# EAGLE design 3_Phase_Controller_V0.1 (EAGLE 9.6.2)
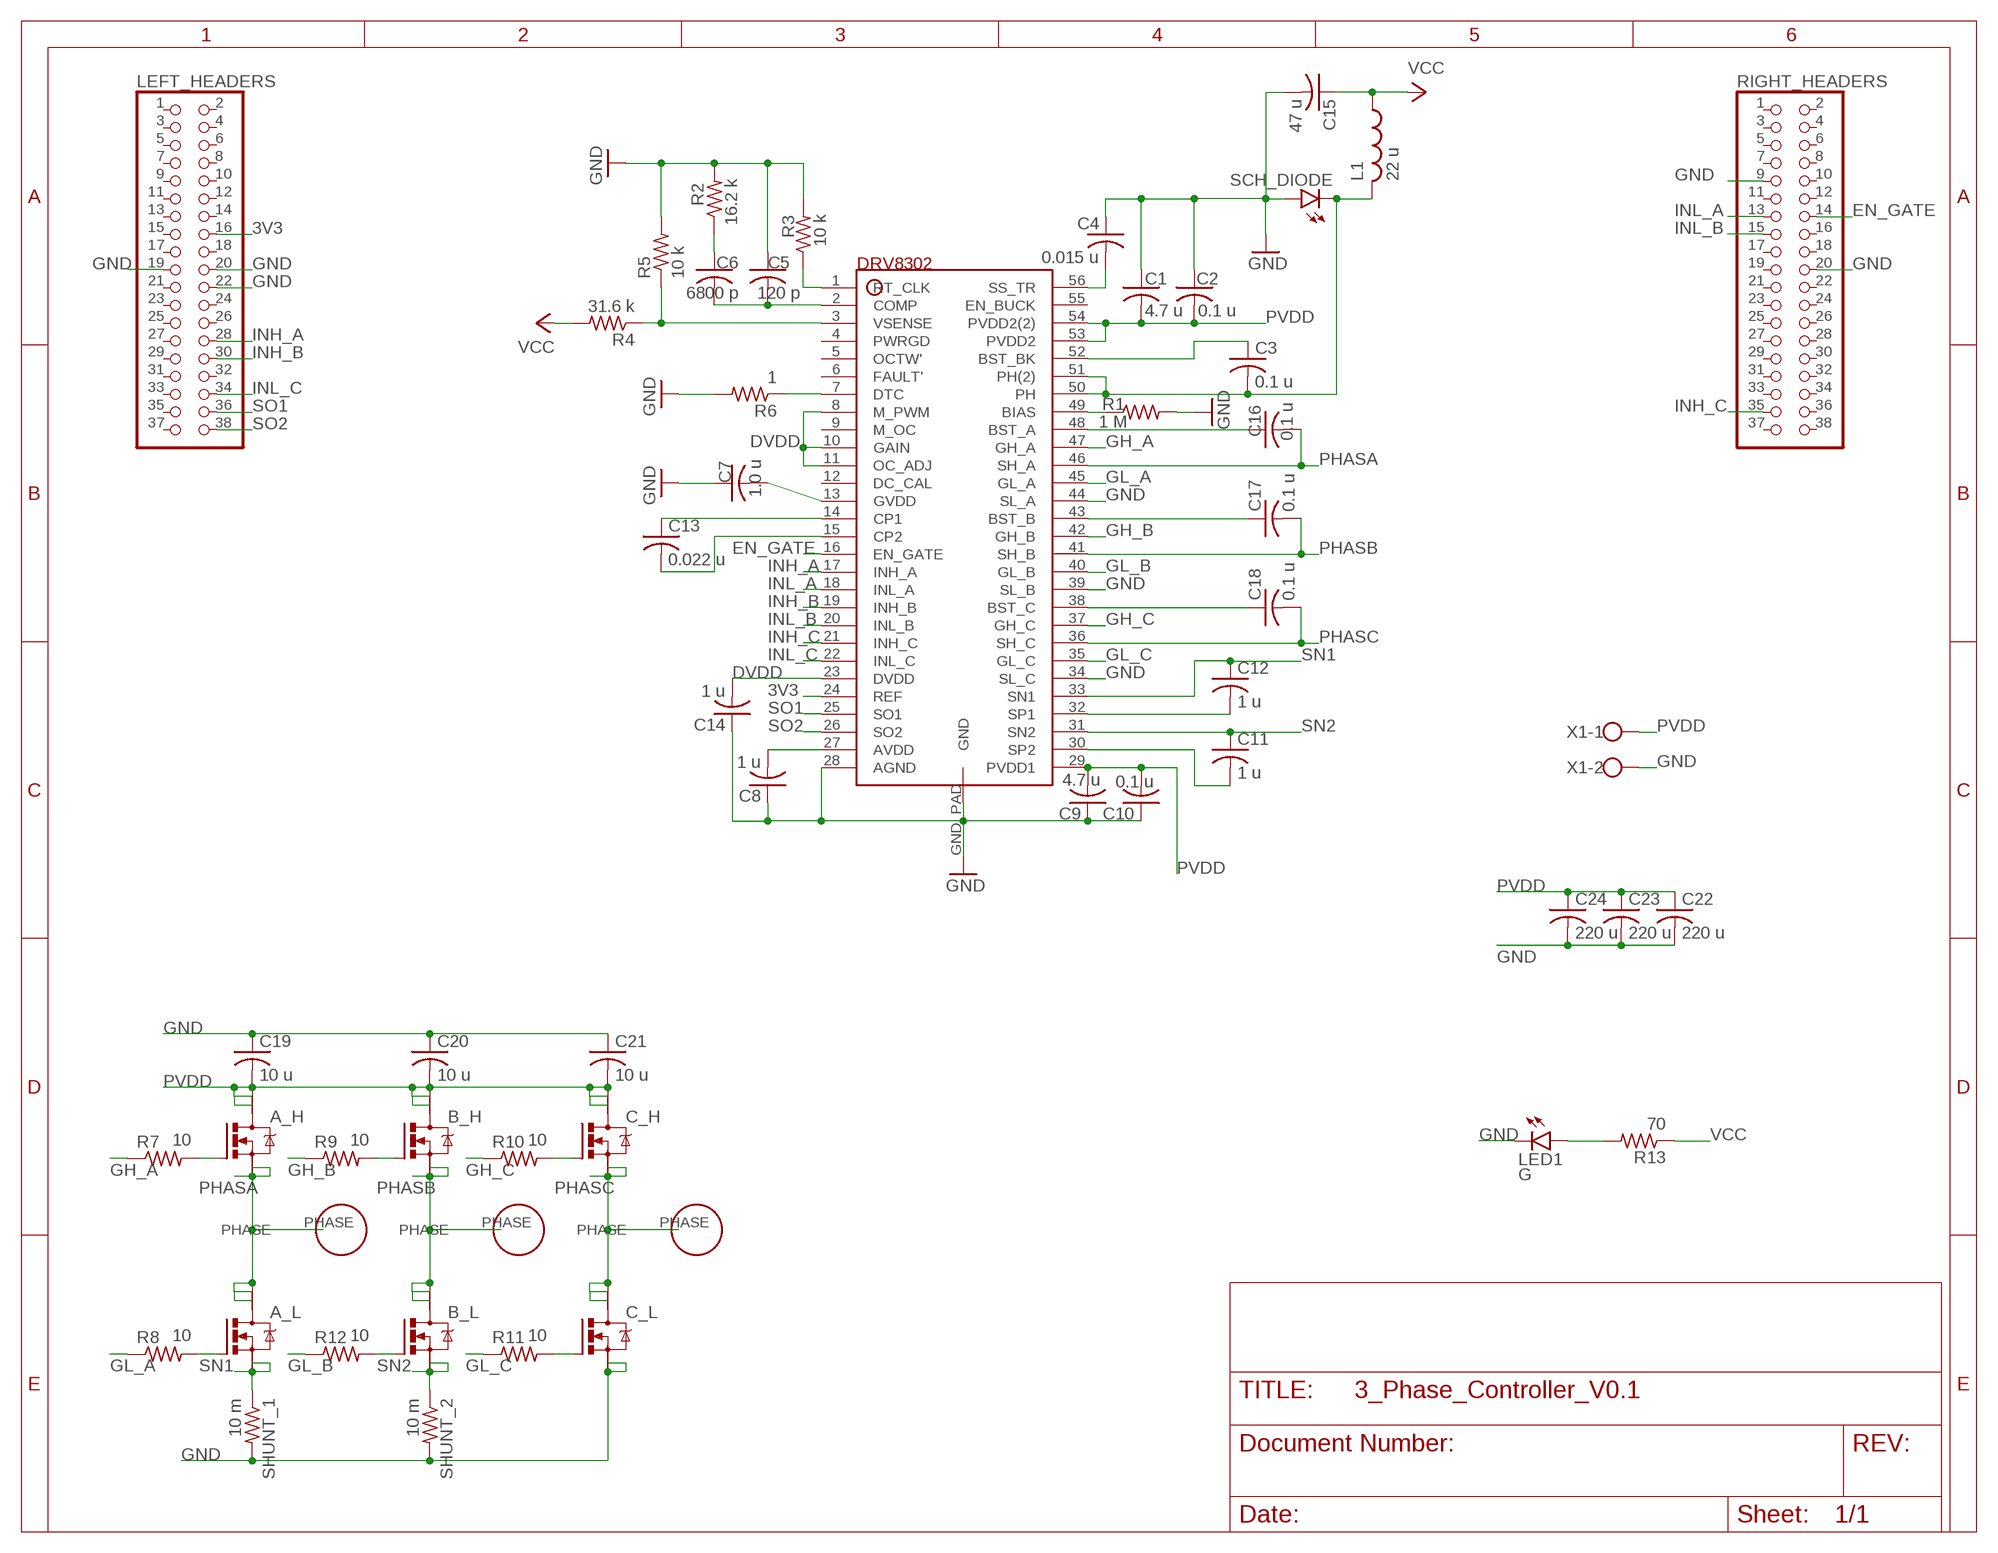
[diagram p0: schematic, sheet 1]

## Parts
A  PHASE_HOLE  [HOLE]
A_H  N-MOSFET-SO8S  [SO-08]
A_L  N-MOSFET-SO8S  [SO-08]
B  PHASE_HOLE  [HOLE]
B_H  N-MOSFET-SO8S  [SO-08]
B_L  N-MOSFET-SO8S  [SO-08]
C  PHASE_HOLE  [HOLE]
C1  4.7 u  C-USC0805  [C0805]
C2  0.1 u  C-USC0805  [C0805]
C3  0.1 u  C-USC0805  [C0805]
C4  0.015 u  C-USC0805  [C0805]
C5  120 p  C-USC0805  [C0805]
C6  6800 p  C-USC0805  [C0805]
C7  1.0 u  C-USC0805  [C0805]
C8  1 u  C-USC0805  [C0805]
C9  4.7 u  C-USC0805  [C0805]
C10  0.1 u  C-USC0805  [C0805]
C11  1 u  C-USC0805  [C0805]
C12  1 u  C-USC0805  [C0805]
C13  0.022 u  C-USC0805  [C0805]
C14  1 u  C-USC0805  [C0805]
C15  47 u  C-US025-024X044  [C025-024X044]
C16  0.1 u  C-USC0805  [C0805]
C17  0.1 u  C-USC0805  [C0805]
C18  0.1 u  C-USC0805  [C0805]
C19  10 u  C-USC1206  [C1206]
C20  10 u  C-USC1206  [C1206]
C21  10 u  C-USC1206  [C1206]
C22  220 u  C-US050-045X075  [C050-045X075]
C23  220 u  C-US050-045X075  [C050-045X075]
C24  220 u  C-US050-045X075  [C050-045X075]
C_H  N-MOSFET-SO8S  [SO-08]
C_L  N-MOSFET-SO8S  [SO-08]
DRV8302  DRV8302HTSSOP_56  [HTSSOP56DFD]
L1  22 u  L-USL3225M  [L3225M]
LED1  G  LEDSML0805  [SML0805]
LEFT_HEADERS  F_PINH 2X19  PINHD-2X19  [2X19]
R1  1 M  R-US_R0805  [R0805]
R2  16.2 k  R-US_R0805  [R0805]
R3  10 k  R-US_R0805  [R0805]
R4  31.6 k  R-US_R0805  [R0805]
R5  10 k  R-US_R0805  [R0805]
R6  1  R-US_R0805  [R0805]
R7  10  R-US_R0805  [R0805]
R8  10  R-US_R0805  [R0805]
R9  10  R-US_R0805  [R0805]
R10  10  R-US_R0805  [R0805]
R11  10  R-US_R0805  [R0805]
R12  10  R-US_R0805  [R0805]
R13  70  R-US_R0805  [R0805]
RIGHT_HEADERS  F_PINH 2X19  PINHD-2X19  [2X19]
SCH_DIODE  LEDCHIP-LED0805  [CHIP-LED0805]
SHUNT_1  10 m  R-US_R2512  [R2512]
SHUNT_2  10 m  R-US_R2512  [R2512]
X1  W237-102  [W237-102]

## Nets
3V3: DRV8302.24(REF) LEFT_HEADERS.16
DVDD: C14.2 DRV8302.8(M_PWM) DRV8302.10(GAIN) DRV8302.11(OC_ADJ) DRV8302.23(DVDD)
EN_GATE: DRV8302.16(EN_GATE) RIGHT_HEADERS.14
GH_A: DRV8302.47(GH_A) R7.1
GH_B: DRV8302.42(GH_B) R9.1
GH_C: DRV8302.37(GH_C) R10.1
GL_A: DRV8302.45(GL_A) R8.1
GL_B: DRV8302.40(GL_B) R12.1
GL_C: DRV8302.35(GL_C) R11.1
GND: C1.1 C2.1 C4.1 C5.1 C7.1 C8.1 C9.1 C10.1 C14.1 C15.2 C19.1 C20.1 C21.1 C22.2 C23.2 C24.2 C_L.1(S) C_L.2(S) DRV8302.28(AGND) DRV8302.34(SL_C) DRV8302.39(SL_B) DRV8302.44(SL_A) DRV8302.GND_PAD(GND) LED1.C LEFT_HEADERS.19 LEFT_HEADERS.20 LEFT_HEADERS.22 R1.2 R2.2 R3.2 R5.2 R6.2 RIGHT_HEADERS.9 RIGHT_HEADERS.20 SCH_DIODE.A SHUNT_1.2 SHUNT_2.2 X1.2
INH_A: DRV8302.17(INH_A) LEFT_HEADERS.28
INH_B: DRV8302.19(INH_B) LEFT_HEADERS.30
INH_C: DRV8302.21(INH_C) RIGHT_HEADERS.35
INL_A: DRV8302.18(INL_A) RIGHT_HEADERS.13
INL_B: DRV8302.20(INL_B) RIGHT_HEADERS.15
INL_C: DRV8302.22(INL_C) LEFT_HEADERS.34
N$1: LED1.A R13.2
N$3: C3.2 DRV8302.50(PH) DRV8302.51(PH(2)) L1.2 SCH_DIODE.C
N$4: C3.1 DRV8302.52(BST_BK)
N$5: C4.2 DRV8302.56(SS_TR)
N$8: C11.2 DRV8302.30(SP2)
N$9: C12.2 DRV8302.32(SP1)
N$11: DRV8302.7(DTC) R6.1
N$12: C7.2 DRV8302.13(GVDD)
N$13: C8.2 DRV8302.27(AVDD)
N$14: DRV8302.49(BIAS) R1.1
N$15: DRV8302.1(RT_CLK) R3.1
N$16: C5.2 C6.2 DRV8302.2(COMP)
N$17: C6.1 R2.1
N$18: DRV8302.3(VSENSE) R4.1 R5.1
N$19: C13.1 DRV8302.14(CP1)
N$20: C13.2 DRV8302.15(CP2)
N$23: A_H.4(G) R7.2
N$24: C17.1 DRV8302.43(BST_B)
N$25: A_L.4(G) R8.2
N$26: B_H.4(G) R9.2
N$27: C_H.4(G) R10.2
N$28: C18.1 DRV8302.38(BST_C)
N$29: C_L.4(G) R11.2
N$30: C16.1 DRV8302.48(BST_A)
N$31: B_L.4(G) R12.2
PHASA: A.PHASE A_H.1(S) A_H.2(S) A_L.5(D) A_L.6(D) A_L.7(D) C16.2 DRV8302.46(SH_A)
PHASB: B.PHASE B_H.1(S) B_H.2(S) B_L.5(D) B_L.6(D) B_L.7(D) C17.2 DRV8302.41(SH_B)
PHASC: C18.2 C.PHASE C_H.1(S) C_H.2(S) C_L.5(D) C_L.6(D) C_L.7(D) DRV8302.36(SH_C)
PVDD: A_H.5(D) A_H.6(D) A_H.7(D) B_H.5(D) B_H.6(D) B_H.7(D) C1.2 C2.2 C9.2 C10.2 C19.2 C20.2 C21.2 C22.1 C23.1 C24.1 C_H.5(D) C_H.6(D) C_H.7(D) DRV8302.29(PVDD1) DRV8302.53(PVDD2) DRV8302.54(PVDD2(2)) X1.1
SN1: A_L.1(S) A_L.2(S) C12.1 DRV8302.33(SN1) SHUNT_1.1
SN2: B_L.1(S) B_L.2(S) C11.1 DRV8302.31(SN2) SHUNT_2.1
SO1: DRV8302.25(SO1) LEFT_HEADERS.36
SO2: DRV8302.26(SO2) LEFT_HEADERS.38
VCC: C15.1 L1.1 R4.2 R13.1
Unconnected: A_H.3(S) A_H.8(D) A_L.3(S) A_L.8(D) B_H.3(S) B_H.8(D) B_L.3(S) B_L.8(D) C_H.3(S) C_H.8(D) C_L.3(S) C_L.8(D) DRV8302.4(PWRGD) DRV8302.5(OCTW') DRV8302.6(FAULT') DRV8302.9(M_OC) DRV8302.12(DC_CAL) DRV8302.55(EN_BUCK) LEFT_HEADERS.1 LEFT_HEADERS.2 LEFT_HEADERS.3 LEFT_HEADERS.4 LEFT_HEADERS.5 LEFT_HEADERS.6 LEFT_HEADERS.7 LEFT_HEADERS.8 LEFT_HEADERS.9 LEFT_HEADERS.10 LEFT_HEADERS.11 LEFT_HEADERS.12 LEFT_HEADERS.13 LEFT_HEADERS.14 LEFT_HEADERS.15 LEFT_HEADERS.17 LEFT_HEADERS.18 LEFT_HEADERS.21 LEFT_HEADERS.23 LEFT_HEADERS.24 LEFT_HEADERS.25 LEFT_HEADERS.26 LEFT_HEADERS.27 LEFT_HEADERS.29 LEFT_HEADERS.31 LEFT_HEADERS.32 LEFT_HEADERS.33 LEFT_HEADERS.35 LEFT_HEADERS.37 RIGHT_HEADERS.1 RIGHT_HEADERS.2 RIGHT_HEADERS.3 RIGHT_HEADERS.4 RIGHT_HEADERS.5 RIGHT_HEADERS.6 RIGHT_HEADERS.7 RIGHT_HEADERS.8 RIGHT_HEADERS.10 RIGHT_HEADERS.11 RIGHT_HEADERS.12 RIGHT_HEADERS.16 RIGHT_HEADERS.17 RIGHT_HEADERS.18 RIGHT_HEADERS.19 RIGHT_HEADERS.21 RIGHT_HEADERS.22 RIGHT_HEADERS.23 RIGHT_HEADERS.24 RIGHT_HEADERS.25 RIGHT_HEADERS.26 RIGHT_HEADERS.27 RIGHT_HEADERS.28 RIGHT_HEADERS.29 RIGHT_HEADERS.30 RIGHT_HEADERS.31 RIGHT_HEADERS.32 RIGHT_HEADERS.33 RIGHT_HEADERS.34 RIGHT_HEADERS.36 RIGHT_HEADERS.37 RIGHT_HEADERS.38

## Library data of the parts
A B C = Brad_Library:PHASE_HOLE
A_H A_L B_H B_L C_H C_L = transistor-power:N-MOSFET-SO8: N-Channel MOSFET Example: FDS7760A; N-Channel Logic Level PowerTrench® MOSFET FDS2572; N-Channel UltraFET® Trench MOSFET Source: www.fairchildsemi.com
C1-C24 = rcl:C-US: CAPACITOR, American symbol; SPICEPREFIX: C
DRV8302 = Brad_Library:DRV8302: 3 phase gate driving/do-all chip
L1 = rcl:L-US: INDUCTOR, American symbol; SPICEPREFIX: L
LED1 SCH_DIODE = led:LED: LED OSRAM: - CHIPLED LG R971, LG N971, LY N971, LG Q971, LY Q971, LO R971, LY R971 LH N974, LH R974 LS Q976, LO Q976, LY Q976 LO Q996 - Hyper CHIPLED LW Q18S LB Q993, LB Q99A, LB R99A - SideLED LS A670, LO A670, LY A670, LG A670, LP A670 LB A673, LV A673, LT A673, LW A673 LH A674 LY A675 LS A676, LA A676, LO A676, LY A676, LW A676 LS A679, LY A679, LG A679 - Hyper Micro SIDELED® LS Y876, LA Y876, LO Y876, LY Y876 LT Y87S - SmartLED LW L88C, LW L88S LB L89C, LB L89S, LG L890 LS L89K, LO L89K, LY L89K LS L896, LA L896, LO L896, LY L896 - TOPLED LS T670, LO T670, LY T670, LG T670, LP T670 LSG T670, LSP T670, LSY T670, LOP T670, LYG T670 LG T671, LOG T671, LSG T671 LB T673, LV T673, LT T673, LW T673 LH T674 LS T676, LA T676, LO T676, LY T676, LB T676, LH T676, LSB T676, LW T676 LB T67C, LV T67C, LT T67C, LS T67K, LO T67K, LY T67K, LW E67C LS E67B, LA E67B, LO E67B, LY E67B, LB E67C, LV E67C, LT E67C LW T67C LS T679, LY T679, LG T679 LS T770, LO T770, LY T770, LG T770, LP T770 LB T773, LV T773, LT T773, LW T773 LH T774 LS E675, LA E675, LY E675, LS T675 LS T776, LA T776, LO T776, LY T776, LB T776 LHGB T686 LT T68C, LB T68C - Hyper Mini TOPLED® LB M676 - Mini TOPLED Santana® LG M470 LS M47K, LO M47K, LY M47K Source: http://www.osram.convergy.de LUXEON: - LUMILED® LXK2-PW12-R00, LXK2-PW12-S00, LXK2-PW14-U00, LXK2-PW14-V00 LXK2-PM12-R00, LXK2-PM12-S00, LXK2-PM14-U00 LXK2-PE12-Q00, LXK2-PE12-R00, LXK2-PE12-S00, LXK2-PE14-T00, LXK2-PE14-U00 LXK2-PB12-K00, LXK2-PB12-L00, LXK2-PB12-M00, LXK2-PB14-N00, LXK2-PB14-P00, LXK2-PB14-Q00 LXK2-PR12-L00, LXK2-PR12-M00, LXK2-PR14-Q00, LXK2-PR14-R00 LXK2-PD12-Q00, LXK2-PD12-R00, LXK2-PD12-S00 LXK2-PH12-R00, LXK2-PH12-S00 LXK2-PL12-P00, LXK2-PL12-Q00, LXK2-PL12-R00 Source: www.luxeon.com KINGBRIGHT: KA-3528ASYC Source: www.kingbright.com
LEFT_HEADERS RIGHT_HEADERS = pinhead:PINHD-2X19: PIN HEADER
R1-R13 SHUNT_1 SHUNT_2 = rcl:R-US_: RESISTOR, American symbol; SPICEPREFIX: R
X1 = con-wago-500:W237-102: WAGO SCREW CLAMP; MPN: 237-102; OC_FARNELL: unknown; OC_NEWARK: 70K9898

## Board
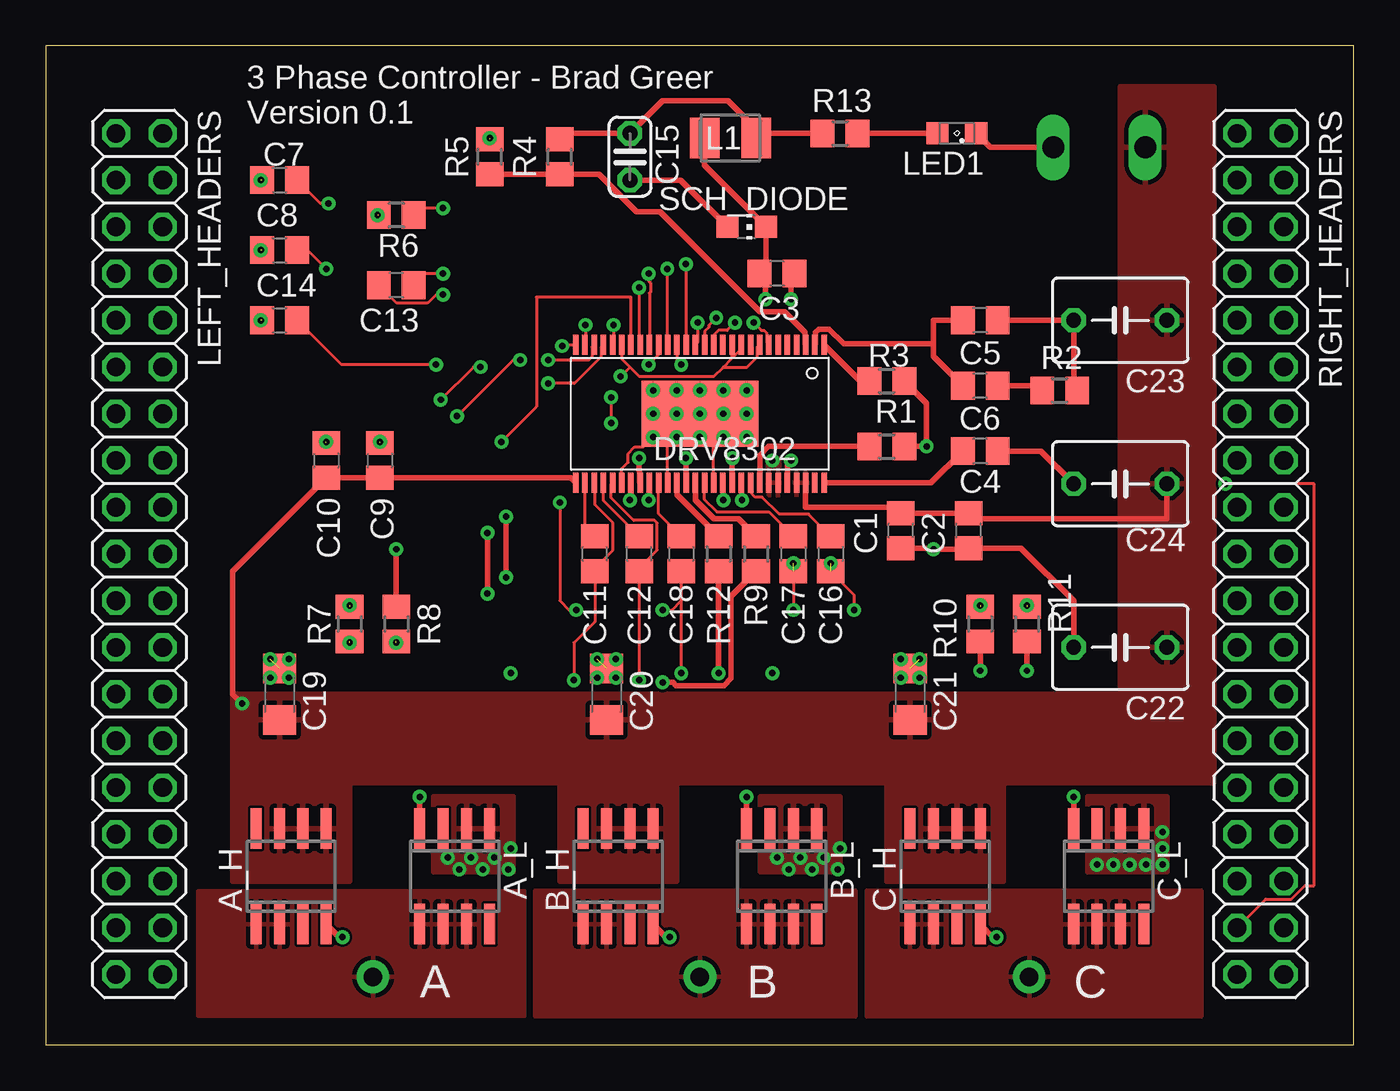
[diagram p1: board, top side]
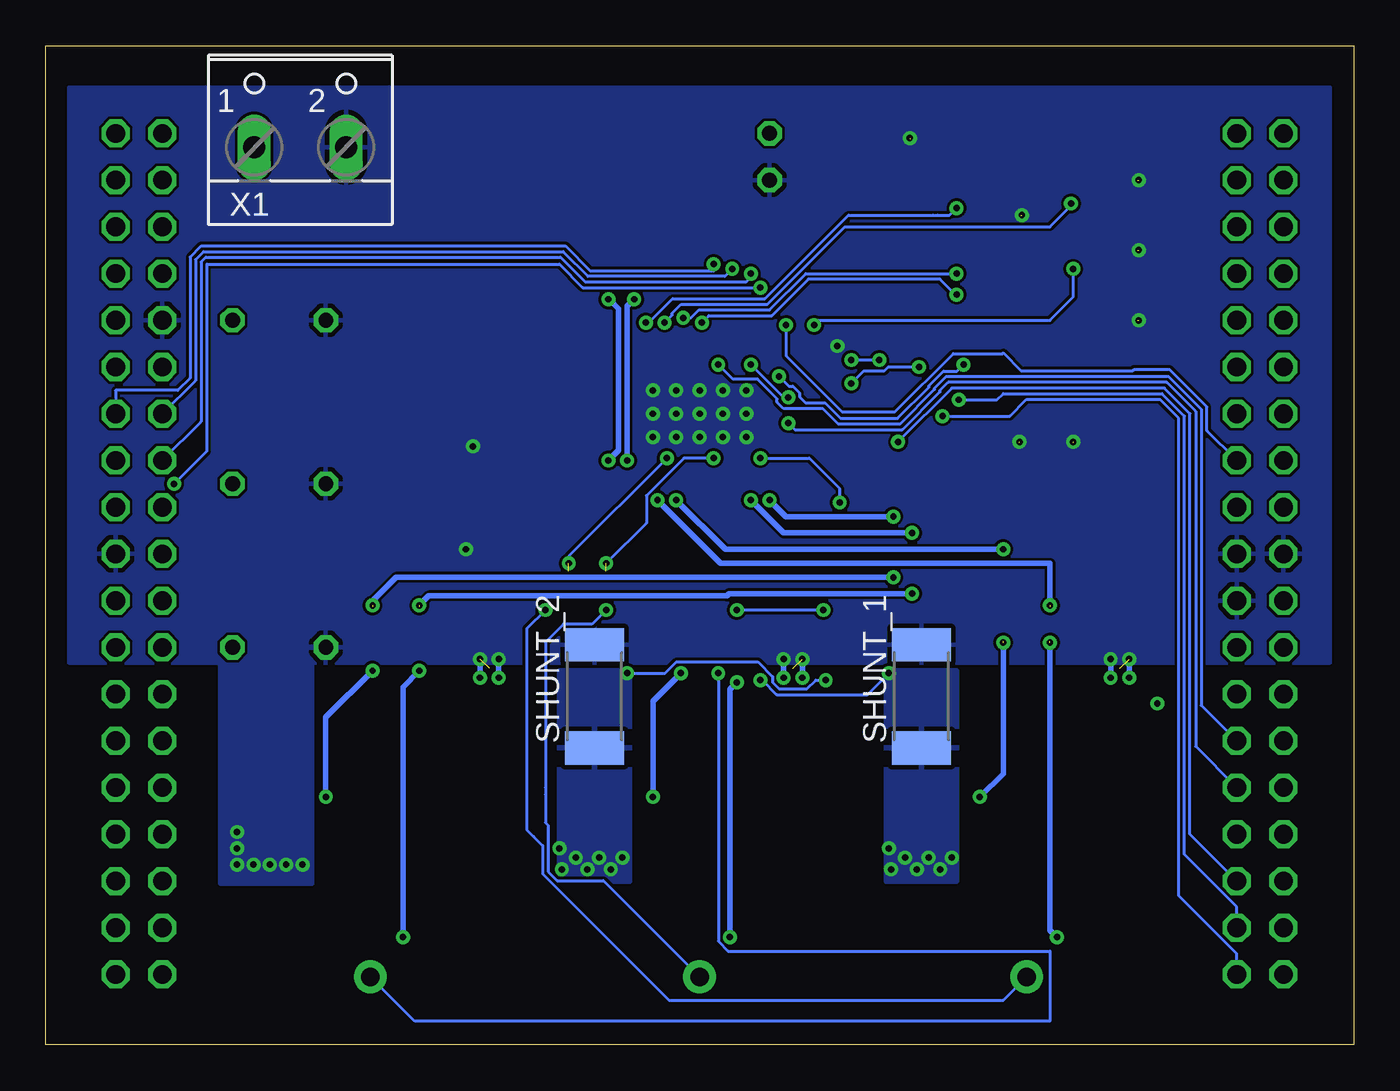
[diagram p2: board, bottom side, seen from below]

Size 71.1 x 54.28 mm. Coordinates in mm from the lower left corner, seen from the top.
Outline: 0,0 71.1,0 71.1,54.28 0,54.28 0,0
Copper layers (1*16): Top 0.035mm / dielectric 1.5mm / Bottom 0.035mm
Design rules "default": minimum track width 6mil, minimum drill 0.35mm, track to track 6mil, track to pad 6mil, pad to pad 6mil, via to via 6mil, smd to smd 6mil, copper to edge 40mil, drill to drill 6mil, minimum pad ring 10mil, minimum via ring 8mil, stop-mask expansion 4mil, vias tented up to drill 0mil, thermal gap 10mil

### Footprints (pad centres in the part's own frame; a part is rotated, then mirrored left to right if it is on the bottom)
HOLE = drill 1 pad 1.778: PHASE 0,0
SO-08 = smd 0.6 x 2.2: 1 -1.905,-2.6; 2 -0.635,-2.6; 3 0.635,-2.6; 4 1.905,-2.6; 5 1.905,2.6; 6 0.635,2.6; 7 -0.635,2.6; 8 -1.905,2.6
C0805 = smd 1.3 x 1.5: 1 -0.95,0; 2 0.95,0
C025-024X044 = drill 0.813 octagon: 1 -1.27,0; 2 1.27,0
C1206 = smd 1.6 x 1.8: 1 -1.4,0; 2 1.4,0
C050-045X075 = drill 0.813 octagon: 1 -2.54,0; 2 2.54,0
HTSSOP56DFD = smd 0.3 x 1.1: 1 -6.75,-3.75; 2 -6.25,-3.75; 3 -5.75,-3.75; 4 -5.25,-3.75; 5 -4.75,-3.75; 6 -4.25,-3.75; 7 -3.75,-3.75; 8 -3.25,-3.75; 9 -2.75,-3.75; 10 -2.25,-3.75; 11 -1.75,-3.75; 12 -1.25,-3.75; 13 -0.75,-3.75; 14 -0.25,-3.75; 15 0.25,-3.75; 16 0.75,-3.75; 17 1.25,-3.75; 18 1.75,-3.75; 19 2.25,-3.75; 20 2.75,-3.75; 21 3.25,-3.75; 22 3.75,-3.75; 23 4.25,-3.75; 24 4.75,-3.75; 25 5.25,-3.75; 26 5.75,-3.75; 27 6.25,-3.75; 28 6.75,-3.75; 29 6.75,3.75; 30 6.25,3.75; 31 5.75,3.75; 32 5.25,3.75; 33 4.75,3.75; 34 4.25,3.75; 35 3.75,3.75; 36 3.25,3.75; 37 2.75,3.75; 38 2.25,3.75; 39 1.75,3.75; 40 1.25,3.75; 41 0.75,3.75; 42 0.25,3.75; 43 -0.25,3.75; 44 -0.75,3.75; 45 -1.25,3.75; 46 -1.75,3.75; 47 -2.25,3.75; 48 -2.75,3.75; 49 -3.25,3.75; 50 -3.75,3.75; 51 -4.25,3.75; 52 -4.75,3.75; 53 -5.25,3.75; 54 -5.75,3.75; 55 -6.25,3.75; 56 -6.75,3.75 | smd 6.35 x 3.607: GND_PAD 0,0
L3225M = smd 1.6 x 2.2: 1 -1.4,0; 2 1.4,0
SML0805 = smd 1.2 x 1.2: A 1.05,0; C -1.05,0
2X19 = drill 1.016 octagon: 1 -22.86,-1.27; 2 -22.86,1.27; 3 -20.32,-1.27; 4 -20.32,1.27; 5 -17.78,-1.27; 6 -17.78,1.27; 7 -15.24,-1.27; 8 -15.24,1.27; 9 -12.7,-1.27; 10 -12.7,1.27; 11 -10.16,-1.27; 12 -10.16,1.27; 13 -7.62,-1.27; 14 -7.62,1.27; 15 -5.08,-1.27; 16 -5.08,1.27; 17 -2.54,-1.27; 18 -2.54,1.27; 19 0,-1.27; 20 0,1.27; 21 2.54,-1.27; 22 2.54,1.27; 23 5.08,-1.27; 24 5.08,1.27; 25 7.62,-1.27; 26 7.62,1.27; 27 10.16,-1.27; 28 10.16,1.27; 29 12.7,-1.27; 30 12.7,1.27; 31 15.24,-1.27; 32 15.24,1.27; 33 17.78,-1.27; 34 17.78,1.27; 35 20.32,-1.27; 36 20.32,1.27; 37 22.86,-1.27; 38 22.86,1.27
R0805 = smd 1.3 x 1.5: 1 -0.95,0; 2 0.95,0
CHIP-LED0805 = smd 1.2 x 1.2: A 0,-1.05; C 0,1.05
R2512 = smd 1.8 x 3.2: 1 -2.8,0; 2 2.8,0
W237-102 = drill 1.194 long: 1 -2.5,-1.27; 2 2.5,-1.27

### Placement (x,y rotation side)
A  17.78,3.68 0 top
A_H  13.34,9.14 0 top
A_L  22.23,9.14 180 top
B  35.56,3.68 0 top
B_H  31.11,9.14 0 top
B_L  40.01,9.14 180 top
C  53.47,3.68 0 top
C1  46.48,27.94 90 top
C2  50.16,27.94 90 top
C3  39.75,41.91 180 top
C4  50.8,32.26 180 top
C5  50.8,39.37 180 top
C6  50.8,35.81 180 top
C7  12.7,46.99 0 top
C8  12.7,43.18 0 top
C9  18.16,31.75 270 top
C10  15.24,31.75 270 top
C11  29.84,26.67 90 top
C12  32.26,26.67 90 top
C13  19.05,41.27 180 top
C14  12.7,39.37 0 top
C15  31.75,48.26 270 top
C16  42.67,26.67 270 top
C17  40.64,26.67 270 top
C18  34.54,26.67 270 top
C19  12.7,19.05 270 top
C20  30.48,19.05 270 top
C21  46.99,19.05 270 top
C22  58.42,21.59 180 top
C23  58.42,39.37 180 top
C24  58.42,30.48 180 top
C_H  48.9,9.14 0 top
C_L  57.78,9.14 180 top
DRV8302  35.56,34.29 180 top
L1  37.21,49.28 180 top
LED1  49.53,49.53 180 top
LEFT_HEADERS  5.08,26.67 270 top
R1  45.72,32.51 0 top
R2  55.12,35.56 0 top
R3  45.72,36.07 0 top
R4  27.94,48.26 90 top
R5  24.13,48.26 90 top
R6  19.05,45.09 180 top
R7  16.51,22.86 270 top
R8  19.05,22.86 270 top
R9  38.61,26.67 270 top
R10  50.8,22.86 270 top
R11  53.34,22.86 270 top
R12  36.58,26.67 270 top
R13  43.18,49.53 0 top
RIGHT_HEADERS  66.04,26.67 270 top
SCH_DIODE  38.1,44.45 270 top
SHUNT_1  23.5,18.92 90 bottom
SHUNT_2  41.27,18.92 90 bottom
X1  57.28,50.04 0 bottom

### Tracks (layer width: path | path; a pad name or v marks a point on that pad's centre or on a via)
3V3  (via drill 0.35)
  Top 0.152: v30.86,39.12 30.86,38.09 DRV8302.24
  Bottom 0.152: LEFT_HEADERS.16 7.98,33.38 7.98,34.67 10.01,36.7 11.94,36.7 12,36.64 18.1,36.64 19.05,37.59 19.08,37.56 21.77,37.56 24.93,34.4 27.83,34.4 30.86,37.44 v30.86,39.12
DVDD  (via drill 0.35)
  Top 0.152: DRV8302.23 31.31,37.27 31.75,36.83 | 31.75,36.83 32.26,36.32 36.32,36.32 36.83,36.83 | 36.83,36.83 37.31,37.31 | 37.31,37.31 DRV8302.11 | 37.31,37.31 37.81,37.81 DRV8302.10 | DRV8302.8 38.69,37.92 38.69,37.4 38.12,36.83 36.83,36.83 | v31.24,36.32 31.75,36.83 | v21.21,36.96 16.06,36.96 C14.2
  Bottom 0.152: v31.24,36.32 30.71,35.79 30.48,35.79 30.13,35.43 30.13,35.21 29.8,34.88 28.73,34.88 27.89,34.04 24.79,34.04 23.09,35.74 23.09,35.81 22.3,36.6 21.57,36.6 v21.21,36.96
EN_GATE  (via drill 0.35)
  Top 0.152: v34.8,42.42 34.8,38.05 DRV8302.16
  Bottom 0.152: RIGHT_HEADERS.14 67.31,35.56 63.93,35.56 63.27,36.22 63.27,42.8 62.66,43.41 42.85,43.41 41.5,42.06 34.8,42.06 v34.8,42.42
GH_A  (via drill 0.35)  (1 unrouted)
  Top 0.305: DRV8302.47 37.81,29.63 v37.85,29.59
  Bottom 0.305: v37.85,29.59 34.42,26.16 16.51,26.16 v16.51,23.88
GH_B
  Top 0.305: R9.1 37.65,28.57 36.32,28.57 35.31,29.59 DRV8302.42
GH_C  (via drill 0.35)  (1 unrouted)
  Top 0.305: DRV8302.37 32.81,29.64 v32.77,29.59 | v24,27.81 v24,24.51
  Bottom 0.305: v32.77,29.59 30.99,27.81 v24,27.81 | v24,24.51 33.95,24.51 34.07,24.39 50.29,24.39 v50.8,23.88
GL_A  (via drill 0.35)
  Top 0.305: DRV8302.45 36.81,29.61 v36.83,29.59 | v19.05,26.92 R8.1
  Bottom 0.305: v36.83,29.59 34.16,26.92 v19.05,26.92
GL_B
  Top 0.305: R12.1 34.31,29.89 DRV8302.40
GL_C  (via drill 0.35)  (1 unrouted)
  Top 0.305: DRV8302.35 31.81,29.65 v31.75,29.59 | v25.02,28.7 v25.02,25.4
  Bottom 0.305: v31.75,29.59 30.86,28.7 v25.02,28.7 | v53.34,23.88 53.34,24.13 52.07,25.4 v25.02,25.4
GND  (via drill 0.35)  (10 unrouted)
  Top 0.152: DRV8302.39 33.81,32.54 v34.29,33.02 | DRV8302.34 31.31,31.31 31.65,31.65 31.65,32.13 32.01,32.48 32.48,32.48 v33.02,33.02 | DRV8302.44 36.31,32.5 v36.83,33.02 | v28.07,37.97 28.13,38.04 DRV8302.28
  Top 0.305: C1.1 48.19,26.99 v48.26,26.92 50.1,26.92 C2.1 53.02,26.99 55.88,24.13 C22.2 | LED1.C 51.34,48.77 X1.2 | R1.2 v47.88,32.51 47.88,34.86 R3.2 | R2.2 55.88,35.75 C23.2 C5.1 | C4.1 54.1,32.26 C24.2 | C15.2 34.51,46.99 SCH_DIODE.A
  Bottom 0.305: v12.19,19.94 v12.19,20.95 | v13.21,19.94 v13.21,20.95 | v29.97,19.94 v29.97,20.95 | v30.99,19.94 v30.99,20.95 | v46.48,19.94 v46.48,20.95 | v47.5,19.94 v47.5,20.95
  other vias: 35.56,34.29 33.02,35.56 33.02,34.29 34.29,34.29 34.29,35.56 35.56,35.56 35.56,33.02 38.1,33.02 38.1,34.29 38.1,35.56 36.83,34.29 36.83,35.56 57.15,9.78 58.04,9.78 58.93,9.78 59.82,9.78 60.71,9.78 15.24,32.77 18.16,32.77 11.68,39.37 11.68,43.18 11.68,46.99 18.03,45.09 24.13,49.28 60.71,10.67 60.71,11.56
  pour Bottom: 1.27,20.7 69.85,20.7 69.85,52.07 1.27,52.07
  pour Top: 56.64,13.46 60.96,13.46 60.96,9.4 56.64,9.4
  pour Bottom: 56.64,21.84 56.64,8.76 61.59,8.76 61.59,21.84
INH_A  (via drill 0.35)
  Top 0.152: DRV8302.17 34.31,37.19 v34.54,36.96
  Bottom 0.152: LEFT_HEADERS.28 8.28,18.44 8.28,34.54 10.03,36.3 22.17,36.3 22.78,35.69 22.78,35.61 24.66,33.73 28.02,33.73 28.86,34.57 30.98,34.57 31.34,34.93 31.34,35.1 32.41,36.17 33.75,36.17 v34.54,36.96
INH_B  (via drill 0.35)
  Top 0.152: DRV8302.19 33.31,37.5 v32.77,36.96 | v30.73,35.18 v30.73,33.78
  Bottom 0.152: LEFT_HEADERS.30 8.59,16.2 8.59,34.42 10.16,35.99 22.05,35.99 22.48,35.56 22.48,35.48 24.54,33.43 30.38,33.43 v30.73,33.78 | v32.77,36.96 30.99,35.18 v30.73,35.18
INH_C  (via drill 0.35)
  Top 0.152: RIGHT_HEADERS.35 66.32,7.9 67.72,7.9 68.46,8.64 68.96,8.64 68.96,30.48 v64.14,30.48 | v32.26,41.15 32.26,38.09 DRV8302.21
  Bottom 0.152: v64.14,30.48 62.36,32.26 62.36,42.42 43.18,42.42 41.91,41.15 v32.26,41.15
INL_A  (via drill 0.35)
  Top 0.152: v33.78,42.16 33.78,38.07 DRV8302.18
  Bottom 0.152: RIGHT_HEADERS.13 62.97,36.09 62.97,42.67 62.53,43.1 42.98,43.1 41.63,41.76 34.19,41.76 v33.78,42.16
INL_B  (via drill 0.35)
  Top 0.152: v32.77,41.91 32.77,41.5 32.87,41.4 32.87,40.9 32.81,40.84 DRV8302.20
  Bottom 0.152: RIGHT_HEADERS.15 62.66,33.86 62.66,42.54 62.41,42.8 43.13,42.8 41.78,41.45 33.02,41.45 32.77,41.71 v32.77,41.91
INL_C  (via drill 0.35)
  Top 0.152: DRV8302.22 31.81,40.64 26.67,40.64 26.67,34.67 v24.77,32.77
  Bottom 0.152: LEFT_HEADERS.34 8.89,11.43 8.89,34.29 10.29,35.69 21.84,35.69 v24.77,32.77
N$1
  Top 0.305: R13.2 LED1.A
N$3  (via drill 0.35)
  Top 0.305: v39.12,40.51 39.12,41.59 C3.2 39.15,42.26 SCH_DIODE.C 35.81,47.79 L1.2
  Bottom 0.305: v39.5,31.75 39.5,40.13 v39.12,40.51
  pour Top: 39.12,31.88 39.12,29.84 40.01,29.84 40.01,31.88
N$4  (via drill 0.35)
  Top 0.152: 40.67,41.88 C3.1
  Top 0.305: v40.51,40.51 40.51,41.72 40.67,41.88 | DRV8302.52 40.31,31.55 v40.51,31.75
  Bottom 0.305: v40.51,31.75 39.95,32.31 39.95,40.01 40.46,40.51 v40.51,40.51
N$5
  Top 0.305: C4.2 48.13,30.54 DRV8302.56
N$8
  Top 0.152: C11.2 29.31,28.16 DRV8302.30
N$9
  Top 0.152: C12.2 30.31,29.57 DRV8302.32
N$11  (via drill 0.35)
  Top 0.152: DRV8302.7 39.19,38.16 39.19,38.69 39.05,38.82 38.91,38.82 v38.48,39.24 | v21.59,45.47 20.38,45.47 R6.1
  Bottom 0.152: v38.48,39.24 38.32,39.24 37.02,40.54 32.01,40.54 27.46,45.09 22.86,45.09 22.61,45.09 21.97,45.09 v21.59,45.47
N$12  (via drill 0.35)
  Top 0.152: v37.47,39.24 37.04,38.82 36.56,38.82 36.31,38.56 DRV8302.13 | v15.37,45.72 14.92,45.72 C7.2
  Bottom 0.152: v37.47,39.24 37.06,39.65 37.06,39.75 36.57,40.24 31.88,40.24 27.67,44.45 16.51,44.45 15.37,45.59 v15.37,45.72
N$13  (via drill 0.35)
  Top 0.152: v29.34,39.12 29.34,38.07 DRV8302.27 | v15.24,42.16 14.22,43.18 C8.2
  Bottom 0.152: v29.34,39.12 29.08,39.37 16.51,39.37 15.24,40.64 v15.24,42.16
N$14
  Top 0.305: DRV8302.49 38.81,32.03 39.29,32.51 R1.1
N$15
  Top 0.305: DRV8302.1 44.28,36.07 R3.1
N$16
  Top 0.305: DRV8302.2 41.85,38.08 41.85,38.71 42.03,38.9 42.59,38.9 43.38,38.1 48.26,38.1 | C5.2 48.26,39.37 48.26,38.1 | C6.2 48.26,37.4 48.26,38.1
N$17
  Top 0.305: R2.1 53.91,35.81 C6.1
N$18
  Top 0.305: DRV8302.3 41.27,38.09 41.27,38.72 40.15,39.83 38.83,39.83 33.4,45.26 32.11,45.26 30.07,47.31 R4.1 R5.1
N$19  (via drill 0.35)
  Top 0.152: v36.45,39.5 36.04,39.09 36.04,38.99 35.81,38.76 DRV8302.14 | v21.59,41.91 20.64,41.91 C13.1
  Bottom 0.152: v21.59,41.91 29.78,41.91 31.75,39.93 35.6,39.93 36.04,39.5 v36.45,39.5
N$20  (via drill 0.35)
  Top 0.152: v35.43,39.24 35.43,38.69 35.43,38.16 DRV8302.15 | v21.59,40.77 21.21,40.77 20.75,40.3 19.08,40.3 C13.2
  Bottom 0.152: v35.43,39.24 35.05,39.63 31.63,39.63 29.65,41.6 22.48,41.6 21.64,40.77 v21.59,40.77
N$23  (via drill 0.35)  (1 unrouted)
  Top 0.305: A_H.4 15.94,5.84 v16.13,5.84
  Bottom 0.305: v16.51,21.84 16.51,6.22 v16.13,5.84
N$24
  Top 0.152: DRV8302.43 35.81,29.63 36.48,28.96 39.3,28.96 C17.1
N$25  (via drill 0.35)  (1 unrouted)
  Top 0.305: A_L.4 v20.32,13.46
  Bottom 0.305: v19.05,21.84 19.05,14.73 v20.32,13.46
N$26  (via drill 0.35)
  Top 0.305: B_H.4 33.72,5.84 v33.91,5.84 | R9.2 37.26,24.37 37.26,19.91 36.86,19.51 34.26,19.51 34.09,19.68 v33.53,19.68
  Bottom 0.305: v33.53,19.68 33.91,19.3 v33.91,5.84
N$27  (via drill 0.35)
  Top 0.305: R10.2 v50.8,20.32 | C_H.4 51.5,5.84 v51.69,5.84
  Bottom 0.305: v50.8,20.32 51.69,19.43 v51.69,5.84
N$28
  Top 0.152: C18.1 33.31,28.85 DRV8302.38
N$29  (via drill 0.35)
  Top 0.305: R11.2 v53.34,20.32 | v55.88,13.46 C_L.4
  Bottom 0.305: v53.34,20.32 55.88,17.78 v55.88,13.46
N$30
  Top 0.152: C16.1 41.46,28.83 39.88,28.83 38.95,29.76 38.56,29.76 38.31,30.02 DRV8302.48
N$31  (via drill 0.35)
  Top 0.305: v38.1,13.46 B_L.4 | R12.2 v36.58,20.19
  Bottom 0.305: v36.58,20.19 38.1,18.67 v38.1,13.46
PHASA  (via drill 0.35)  (1 unrouted)
  Top 0.152: C16.2 43.94,24.45 v43.94,23.62
  Top 0.305: DRV8302.46 37.31,31.85 v37.34,31.88
  Bottom 0.152: v43.94,23.62 44.96,22.61 44.96,11.68 44.58,11.3 44.09,10.82 44.09,9.27 37.23,2.41 19.05,2.41 A.PHASE | v37.34,31.88 42.67,26.54 v42.67,26.16
  pour Top: 8.26,8.38 26.04,8.38 26.04,1.52 8.26,1.52
PHASB  (via drill 0.35)  (1 unrouted)
  Top 0.152: C17.2 v40.64,23.62
  Top 0.305: DRV8302.41 34.8,30.55 v34.8,31.88
  Bottom 0.152: v40.64,23.62 41.41,22.85 42.97,22.85 43.94,21.88 43.94,13.97 43.94,13.59 43.94,12.06 43.79,11.91 43.79,9.4 43.3,8.92 40.8,8.92 B.PHASE | v40.64,26.16 38.45,28.35 38.45,29.84 36.42,31.88 v34.8,31.88
  pour Top: 26.54,8.38 26.54,1.52 44.07,1.52 44.07,8.38
PHASC  (via drill 0.35)
  Top 0.152: C18.2 34.54,24.13 | 34.54,24.13 v34.54,20.19 | v27.94,29.46 27.94,24.13 28.45,23.62 v28.83,23.62 | v33.53,23.62 34.04,23.62 34.54,24.13
  Top 0.305: DRV8302.36 32.27,30.58 32.27,31.21 32.26,31.22 v32.26,31.88
  Bottom 0.152: v32.26,31.88 29.59,31.88 27.94,30.23 v27.94,29.46 | v28.83,23.62 v33.53,23.62 | v34.54,20.19 34.54,5.62 34.01,5.08 16.51,5.08 16.51,1.27 51.05,1.27 C.PHASE
  pour Top: 44.58,8.38 44.58,1.52 62.87,1.52 62.87,8.38
PVDD  (via drill 0.35)
  Top 0.305: DRV8302.54 41.31,29.21 46.16,29.21 C1.2 C2.2 50.23,28.89 50.55,28.57 60.96,28.57 C24.1 | DRV8302.29 28.55,30.8 C9.2 C10.2 10.16,25.72 10.16,19.05 v10.67,18.54
  pour Top: 10.16,15.24 10.16,8.89 16.51,8.89 16.51,15.24
  pour Top: 27.94,15.24 27.94,8.89 34.29,8.89 34.29,15.24
  pour Top: 45.72,15.24 45.72,8.89 52.07,8.89 52.07,15.24
  pour Top: 58.42,52.07 58.42,19.05 10.16,19.05 10.16,14.22 63.5,14.22 63.5,52.07
  pour Top: 40.64,31.24 41.53,31.24 41.53,29.84 40.64,29.84
SN1  (via drill 0.35)
  Top 0.152: DRV8302.33 30.73,30.46 30.73,29.72 31.95,28.5 33.1,28.5 33.24,28.36 33.24,26.88 32.26,25.9 C12.1 v32.26,19.81
  Bottom 0.152: v32.26,19.81 32.15,19.81 31.37,19.03 26.44,19.03 v25.27,20.19
  other vias: 21.84,10.16 22.48,9.53 23.11,10.16 23.75,9.53 24.38,10.16 25.15,9.53 25.27,10.67
  pour Top: 21.08,13.46 25.4,13.46 25.4,9.4 21.08,9.4
  pour Bottom: 21.59,20.32 21.59,8.89 25.4,8.89 25.4,20.32
SN2  (via drill 0.35)
  Top 0.152: DRV8302.31 29.84,30.5 29.84,29.34 30.82,28.36 30.82,26.88 29.84,25.9 C11.1 29.84,22.99 28.7,21.84 v28.7,19.81
  Bottom 0.152: v28.7,19.81 29.24,19.81 29.72,19.33 31.24,19.33 31.59,19.69 31.59,20.01 32.39,20.8 36.83,20.8 37.43,20.19 v39.5,20.19
  other vias: 39.75,10.16 40.39,9.53 41.02,10.16 41.66,9.53 42.29,10.16 43.05,9.53 43.18,10.67
  pour Top: 38.86,13.46 43.18,13.46 43.18,9.4 38.86,9.4
  pour Bottom: 39.37,20.32 39.37,8.89 43.18,8.89 43.18,20.32
SO1  (via drill 0.35)
  Top 0.152: DRV8302.25 30.19,37.92 30.19,37.4 28.73,35.94 v27.3,35.94 | v21.46,35.05 23.24,36.83 v23.62,36.83
  Bottom 0.152: LEFT_HEADERS.36 6.35,7.49 9.2,10.33 9.2,34.16 10.41,35.38 19.05,35.38 19.38,35.05 v21.46,35.05 | v23.62,36.83 25.3,36.83 25.53,36.6 26.64,36.6 v27.3,35.94
SO2  (via drill 0.35)
  Top 0.152: DRV8302.26 29.69,37.92 29.69,37.4 29.5,37.21 v27.3,37.21 | v22.35,34.16 25.4,37.21 v25.78,37.21
  Bottom 0.152: LEFT_HEADERS.38 6.35,4.95 9.5,8.1 9.5,34.04 10.54,35.08 17.78,35.08 18.69,34.16 v22.35,34.16 | v25.78,37.21 v27.3,37.21
VCC
  Top 0.305: L1.1 38.87,49.53 | 38.87,49.53 R13.1 | 38.87,49.53 37.09,51.31 33.53,51.31 C15.1 28.26,49.53 R4.2

### Text on the board
tPlace: 3 Phase Controller - Brad Greer / Version 0.1 | A | B | C